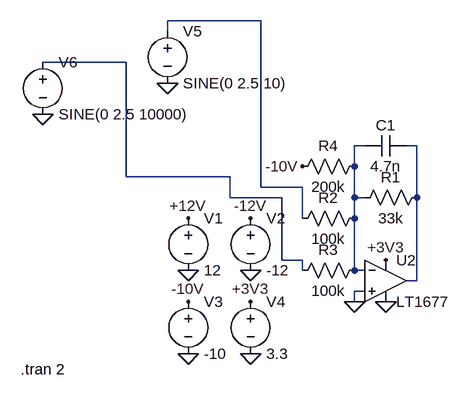
[diagram p0: schematic Draft3.asc]
Draft3.asc, the LTspice schematic file:
Version 4
SHEET 1 880 680
WIRE 96 -240 -48 -240
WIRE -48 -224 -48 -240
WIRE -112 -176 -240 -176
WIRE 256 -48 240 -48
WIRE 336 -48 320 -48
WIRE 240 -16 240 -48
WIRE -112 0 -112 -176
WIRE 48 0 -112 0
WIRE 96 16 96 -240
WIRE 160 16 96 16
WIRE 48 32 48 0
WIRE 128 32 48 32
WIRE 240 32 240 -16
WIRE 256 32 240 32
WIRE 336 32 336 -48
WIRE 160 64 160 16
WIRE 240 64 240 32
WIRE 128 128 128 32
WIRE 160 128 128 128
WIRE 160 144 160 128
WIRE 240 144 240 64
WIRE 256 144 240 144
WIRE 336 160 336 32
WIRE 336 160 320 160
WIRE 256 176 240 176
WIRE 240 192 240 176
FLAG -16 272 0
FLAG 80 272 0
FLAG 80 144 0
FLAG -16 144 0
FLAG -16 64 +12V
FLAG 80 64 -12V
FLAG -16 192 -10V
FLAG 80 192 +3V3
FLAG 288 192 0
FLAG 288 128 +3V3
FLAG 240 192 0
FLAG 160 -16 -10V
FLAG -48 -144 0
FLAG -240 -96 0
SYMBOL voltage -16 48 R0
WINDOW 123 0 0 Left 0
WINDOW 39 0 0 Left 0
SYMATTR InstName V1
SYMATTR Value 12
SYMBOL voltage 80 48 R0
WINDOW 123 0 0 Left 0
WINDOW 39 0 0 Left 0
SYMATTR InstName V2
SYMATTR Value -12
SYMBOL voltage -16 176 R0
WINDOW 123 0 0 Left 0
WINDOW 39 0 0 Left 0
SYMATTR InstName V3
SYMATTR Value -10
SYMBOL voltage 80 176 R0
WINDOW 123 0 0 Left 0
WINDOW 39 0 0 Left 0
SYMATTR InstName V4
SYMATTR Value 3.3
SYMBOL res 352 16 R90
WINDOW 0 0 56 VBottom 2
WINDOW 3 32 56 VTop 2
SYMATTR InstName R1
SYMATTR Value 33k
SYMBOL res 256 48 R90
WINDOW 0 0 56 VBottom 2
WINDOW 3 32 56 VTop 2
SYMATTR InstName R2
SYMATTR Value 100k
SYMBOL res 256 128 R90
WINDOW 0 0 56 VBottom 2
WINDOW 3 32 56 VTop 2
SYMATTR InstName R3
SYMATTR Value 100k
SYMBOL res 256 -32 R90
WINDOW 0 0 56 VBottom 2
WINDOW 3 32 56 VTop 2
SYMATTR InstName R4
SYMATTR Value 200k
SYMBOL voltage -48 -240 R0
WINDOW 123 0 0 Left 0
WINDOW 39 0 0 Left 0
SYMATTR InstName V5
SYMATTR Value SINE(0 2.5 10)
SYMBOL voltage -240 -192 R0
WINDOW 123 0 0 Left 0
WINDOW 39 0 0 Left 0
SYMATTR InstName V6
SYMATTR Value SINE(0 2.5 10000)
SYMBOL Opamps\\LT1677 288 96 R0
SYMATTR InstName U2
SYMBOL cap 320 -64 R90
WINDOW 0 0 32 VBottom 2
WINDOW 3 32 32 VTop 2
SYMATTR InstName C1
SYMATTR Value 4.7n
TEXT -274 296 Left 2 !.tran 2

The netlist it stands for:
* Draft3.asc
V1 +12V 0 12
V2 -12V 0 -12
V3 -10V 0 -10
V4 +3V3 0 3.3
R1 N004 N003 33k
R2 N003 N001 100k
R3 N003 N002 100k
R4 N003 -10V 200k
V5 N001 0 SINE(0 2.5 10)
V6 N002 0 SINE(0 2.5 10000)
XU2 0 N003 +3V3 0 N004 LT1677  ; pins In+ In- V+ V- OUT
C1 N004 N003 4.7n
.tran 2
.lib LTC.lib
.backanno
.end